# EAGLE design visualization_breakout_4_port (EAGLE 6.4)
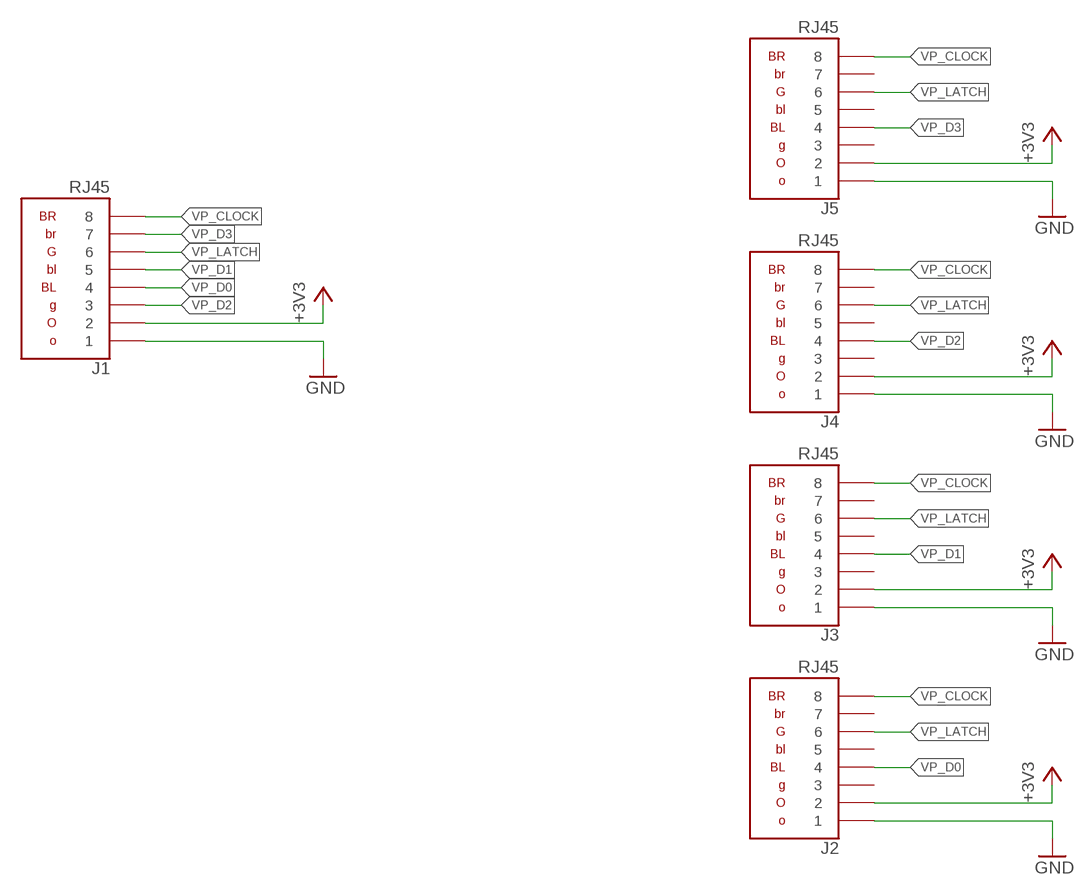
[diagram p0: schematic, sheet 1]

## Parts
J1  RJ45  [RJ45]
J2  RJ45  [RJ45]
J3  RJ45  [RJ45]
J4  RJ45  [RJ45]
J5  RJ45  [RJ45]

## Nets
+3V3: J1.2 J2.2 J3.2 J4.2 J5.2
GND: J1.1 J2.1 J3.1 J4.1 J5.1
VP_CLOCK: J1.8 J2.8 J3.8 J4.8 J5.8
VP_D0: J1.4 J2.4
VP_D1: J1.5 J3.4
VP_D2: J1.3 J4.4
VP_D3: J1.7 J5.4
VP_LATCH: J1.6 J2.6 J3.6 J4.6 J5.6
Unconnected: J2.3 J2.5 J2.7 J3.3 J3.5 J3.7 J4.3 J4.5 J4.7 J5.3 J5.5 J5.7

## Library data of the parts
J1-J5 = TASLink:RJ45

## Board
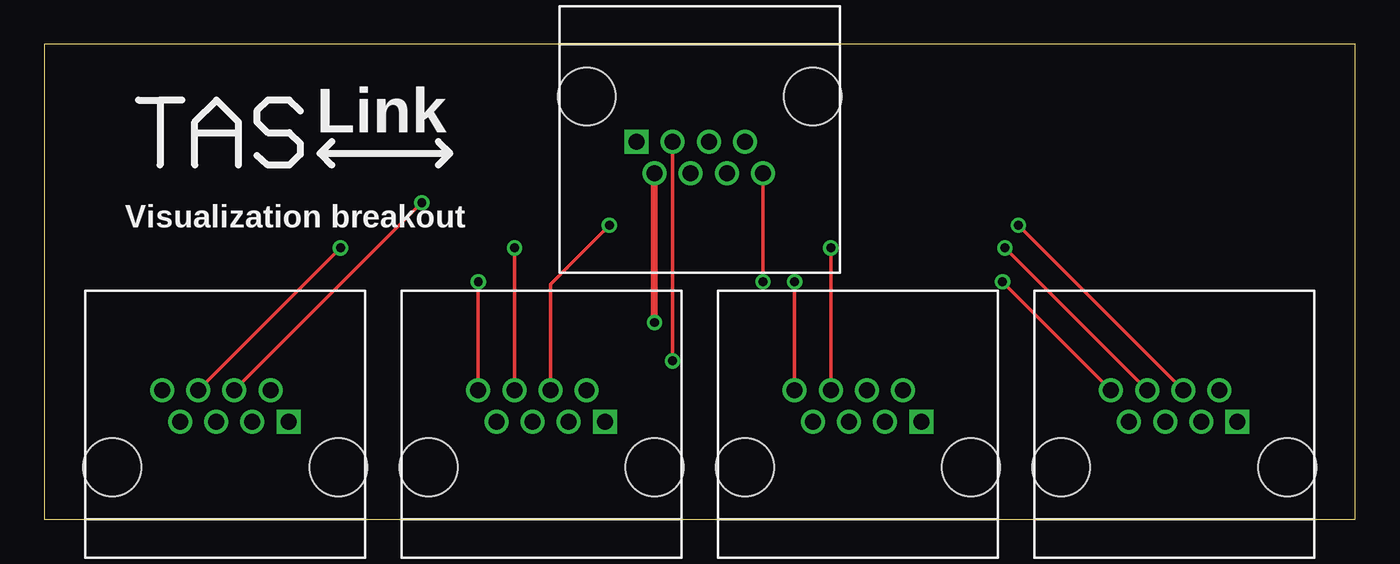
[diagram p1: board, top side]
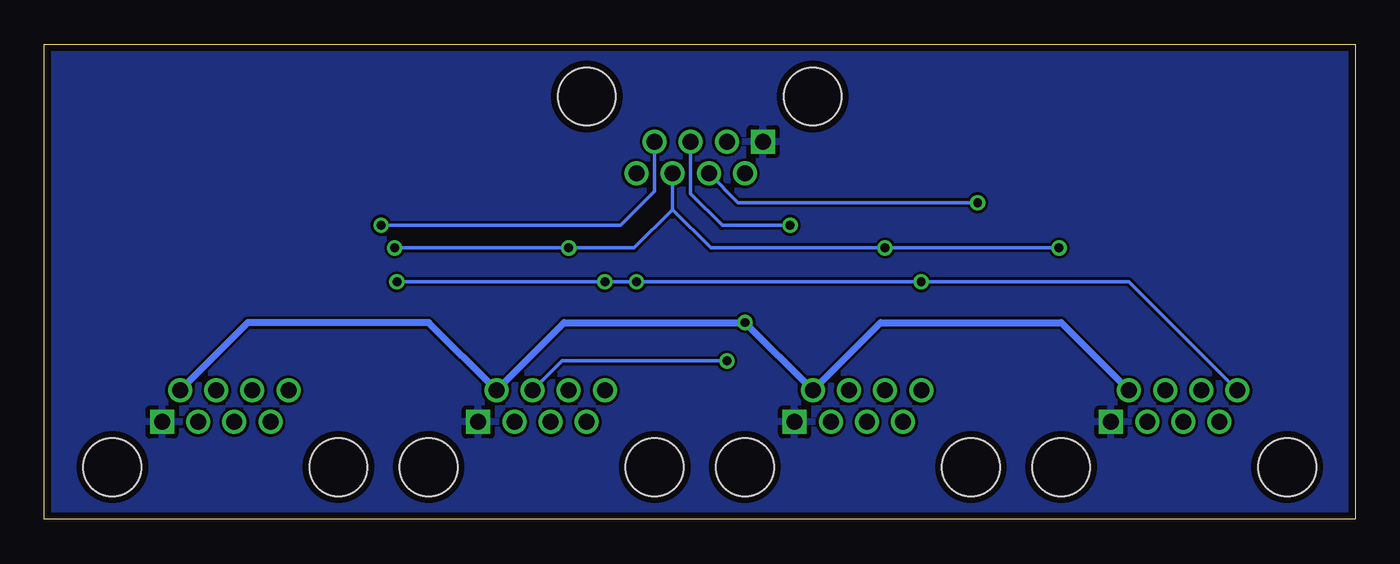
[diagram p2: board, bottom side, seen from below]

Size 73.66 x 26.67 mm. Coordinates in mm from the lower left corner, seen from the top.
Outline: 0,0 73.66,0 73.66,26.67 0,26.67 0,0
Copper layers (1*16): Top 0.0356mm / dielectric 1.5011mm / Bottom 0.0356mm
Design rules "LaenPCBOrder *": minimum track width 6mil, minimum drill 13mil, track to track 6mil, track to pad 6mil, pad to pad 6mil, via to via 6mil, smd to smd 6mil, copper to edge 15mil, drill to drill 6mil, minimum pad ring 7mil, minimum via ring 7mil, stop-mask expansion 3mil, vias tented up to drill 20mil, thermal gap 10mil

### Footprints (pad centres in the part's own frame; a part is rotated, then mirrored left to right if it is on the bottom)
RJ45 = drill 0.9 square: 1 3.556,-0.889 | drill 0.9: 2 2.54,0.889; 3 1.524,-0.889; 4 0.508,0.889; 5 -0.508,-0.889; 6 -1.524,0.889; 7 -2.54,-0.889; 8 -3.556,0.889 | hole 3.251: -6.35,-3.429; 6.35,-3.429

### Placement (x,y rotation side)
J1  36.83,20.32 180 top
J2  10.16,6.35 0 top
J3  27.94,6.35 0 top
J4  45.72,6.35 0 top
J5  63.5,6.35 0 top

### Tracks (layer width: path | path; a pad name or v marks a point on that pad's centre or on a via)
+3V3  (via drill 0.5)
  Top 0.406: v34.29,11.05 J1.2
  Bottom 0.406: J5.2 62.23,11.05 52.07,11.05 J4.2 44.45,11.05 v34.29,11.05 J3.2 26.67,11.05 16.51,11.05 J2.2
GND
  pour Bottom: 0,26.67 73.66,26.67 73.66,0 0,0
VP_CLOCK  (via drill 0.5)
  Top 0.203: J3.8 v24.38,13.34 | J5.8 v53.85,13.34 | v40.39,13.34 J1.8 | J4.8 v42.16,13.34
  Bottom 0.203: J2.8 12.7,13.34 v24.38,13.34 v40.39,13.34 v42.16,13.34 v53.85,13.34
VP_D0  (via drill 0.5)
  Top 0.203: J2.4 v21.21,17.78
  Bottom 0.203: v21.21,17.78 34.67,17.78 J1.4
VP_D1  (via drill 0.5)
  Top 0.203: J3.4 28.45,13.21 v31.75,16.51
  Bottom 0.203: J1.5 37.34,18.29 35.56,16.51 v31.75,16.51
VP_D2  (via drill 0.5)
  Top 0.203: v35.31,8.89 J1.3
  Bottom 0.203: J4.4 44.58,8.89 v35.31,8.89
VP_D3  (via drill 0.5)
  Top 0.203: v54.74,16.51 J5.4
  Bottom 0.203: J1.7 39.37,18.41 41.27,16.51 v54.74,16.51
VP_LATCH  (via drill 0.5)
  Top 0.203: J2.6 v16.64,15.24 | J5.6 v53.98,15.24 | J3.6 v26.42,15.24 | J4.6 v44.2,15.24
  Bottom 0.203: v16.64,15.24 v26.42,15.24 36.2,15.24 38.35,17.4 | v53.98,15.24 v44.2,15.24 40.51,15.24 38.35,17.4 | 38.35,17.4 J1.6

### Text on the board
tPlace: Link | Visualization breakout